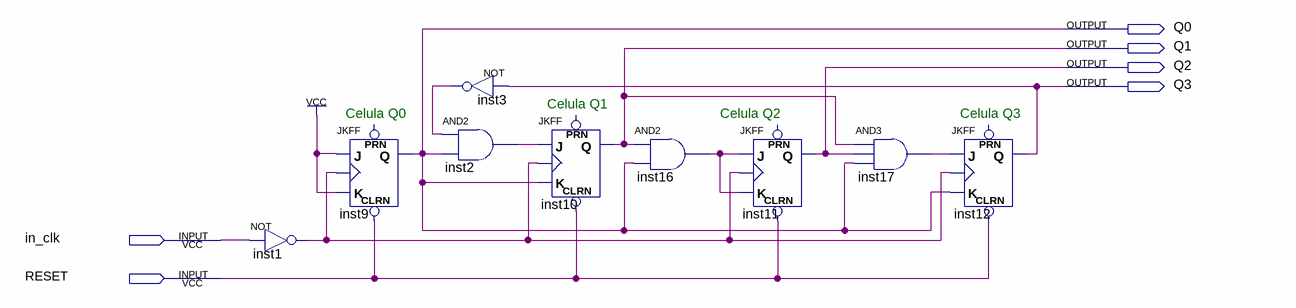
[diagram p0: schematic sheet]
// Quartus schematic numarator_10.bdf as structural Verilog: 9 symbols, 6 pins
module numarator_10 (
  input  in_clk,
  input  RESET,
  output Q0,
  output Q1,
  output Q2,
  output Q3
);

  wire inst1_out, inst2_out, inst3_out, inst16_out, inst17_out;

  not inst1 (inst1_out, in_clk);
  JKFF inst9 (.CLRN(RESET), .K(1'b1), .J(1'b1), .CLK(inst1_out), .Q(Q0));  // open: PRN
  not inst3 (inst3_out, Q3);
  and inst2 (inst2_out, inst3_out, Q0);
  JKFF inst10 (.CLRN(RESET), .K(Q0), .J(inst2_out), .CLK(inst1_out), .Q(Q1));  // open: PRN
  and inst16 (inst16_out, Q1, Q0);
  JKFF inst11 (.CLRN(RESET), .K(inst16_out), .J(inst16_out), .CLK(inst1_out), .Q(Q2));  // open: PRN
  and inst17 (inst17_out, Q1, Q2, Q0);
  JKFF inst12 (.CLRN(RESET), .K(Q0), .J(inst17_out), .CLK(inst1_out), .Q(Q3));  // open: PRN

  // Notes on the sheet:
  //   Celula Q1
  //   Celula Q0
  //   Celula Q2
  //   Celula Q3
endmodule
